# Altium schematic sheet SSR.SchDoc
size B
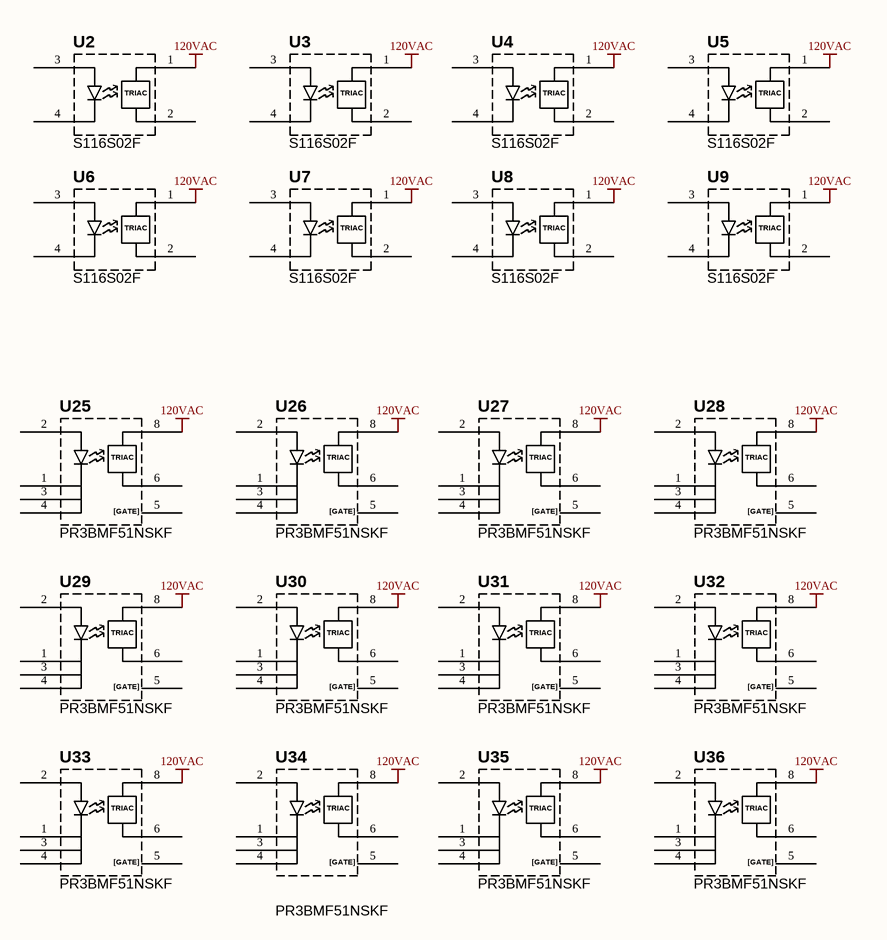
[diagram p0: SSR.SchDoc]

## Parts
U2  S116S02F  [SHARP SIP-4 SSR]
U3  S116S02F  [SHARP SIP-4 SSR]
U4  S116S02F  [SHARP SIP-4 SSR]
U5  S116S02F  [SHARP SIP-4 SSR]
U6  S116S02F  [SHARP SIP-4 SSR]
U7  S116S02F  [SHARP SIP-4 SSR]
U8  S116S02F  [SHARP SIP-4 SSR]
U9  S116S02F  [SHARP SIP-4 SSR]
U25  PR3BMF51NSKF  [DIP8_NO_PIN7]
U26  PR3BMF51NSKF  [DIP8_NO_PIN7]
U27  PR3BMF51NSKF  [DIP8_NO_PIN7]
U28  PR3BMF51NSKF  [DIP8_NO_PIN7]
U29  PR3BMF51NSKF  [DIP8_NO_PIN7]
U30  PR3BMF51NSKF  [DIP8_NO_PIN7]
U31  PR3BMF51NSKF  [DIP8_NO_PIN7]
U32  PR3BMF51NSKF  [DIP8_NO_PIN7]
U33  PR3BMF51NSKF  [DIP8_NO_PIN7]
U34  PR3BMF51NSKF  [DIP8_NO_PIN7]
U35  PR3BMF51NSKF  [DIP8_NO_PIN7]
U36  PR3BMF51NSKF  [DIP8_NO_PIN7]

## Nets
120VAC: U2.1 U3.1 U4.1 U5.1 U6.1 U7.1 U8.1 U9.1 U25.8 U26.8 U27.8 U28.8 U29.8 U30.8 U31.8 U32.8 U33.8 U34.8 U35.8 U36.8

Not connected (* = marked no-connect by the designer): U2 2 3 4; U3 2 3 4; U4 2 3 4; U5 2 3 4; U6 2 3 4; U7 2 3 4; U8 2 3 4; U9 2 3 4; U25 1 2 3 4 5 6; U26 1 2 3 4 5 6; U27 1 2 3 4 5 6; U28 1 2 3 4 5 6; U29 1 2 3 4 5 6; U30 1 2 3 4 5 6; U31 1 2 3 4 5 6; U32 1 2 3 4 5 6; U33 1 2 3 4 5 6; U34 1 2 3 4 5 6; U35 1 2 3 4 5 6; U36 1 2 3 4 5 6

## Notes on the sheet
- 2
- Wavenumber
- pl
- -1
- Rev:
- Technologies
- Sheet
- of
- (in symbol PR3BMF51NSKF) TRIAC; [GATE]
- (in symbol S116S02F) TRIAC

## Library data of the parts
U2-U9 = S116S02F: Solid State Relays - PCB Mount 16A Zero Cross Type Triac output SSR; Manufacturer: Sharp Microelectronics; Load Voltage Rating: 400 V; Supplier 1: Mouser; Manufacturer Part Number: S116S02F; RoHS: RoHS Compliant; Category: Solid State Relays - PCB Mount; Stock 1: 60; Pricing 1: 1=8.07, 10=6.66, 50=6.05, 100=5.85, 250=5.52, 500=5.24, 1000=5.04, 2500=4.83 (AUD); Package / Case: SIP-4; Series: S; Termination Style: Lead Termination; Mounting Style: Through Hole; Product Category: Solid State Relays; Product Type: PCB Mount; Standard Pack Qty: 200; RoHS - Mouser: Y; Minimum Order Quantity: 1; Reeling: False; ComponentLink1URL: http://www.mouser.com/ds/2/365/s216s02_e-184067.pdf; ComponentLink1Description: http://www.mouser.com/ds/2/365/s216s02_e-184067.pdf; Supplier Part Number 1: 852-S116S02F; Value: S116S02F
U25-U36 = PR3BMF51NSKF: RELAY SSR 10MA 240V 1.2A 8-DIP; Manufacturer: Sharp Microelectronics; Circuit: SPST-NO (1 Form A); Output Type: AC; Voltage - Input: 1.2VDC; Voltage - Load: 0 ~ 240 V; Supplier 1: Digi-Key; Supplier Part Number 1: 425-2562-5-ND; Manufacturer Part Number: PR3BMF51NSKF; RoHS: RoHS Compliant; Category: Relays; Stock 1: 973; Pricing 1: 1=1.38, 10=1.1, 25=1.0452, 100=0.9075, 500=0.7975, 750=0.75351, 1000=0.715, 2500=0.6875, 5000=0.671 (USD); Mounting Type: Through Hole; ComponentLink1URL: http://www.sharpsma.com/webfm_send/1389; ComponentLink1Description: http://www.sharpsma.com/webfm_send/1389; Value: PR3BMF51NSKF; Packaging: Tube; On-State Resistance: -; Load Current: 1.2A; Termination Style: PC Pin; Package / Case: 8-DIP (0.300", 7.62mm), 7 Leads; Supplier Device Package: 8-DIP; Relay Type: Relay